# EAGLE design RGb Strip (EAGLE 6.5.0)
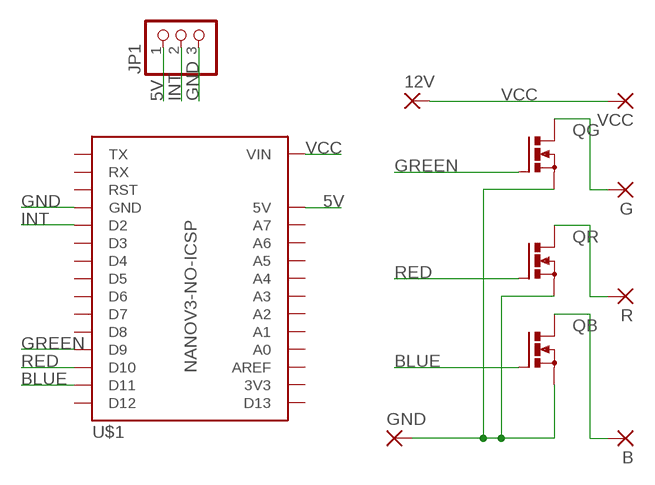
[diagram p0: schematic, sheet 1]

## Parts
12V  1,6/0,9  [1,6/0,9]
B  1,6/0,9  [1,6/0,9]
G  1,6/0,9  [1,6/0,9]
GND  1,6/0,9  [1,6/0,9]
JP1  PINHD-1X3  [1X03]
QB  PMOSFET_NTO220BV  [TO220BV]
QG  PMOSFET_NTO220BV  [TO220BV]
QR  PMOSFET_NTO220BV  [TO220BV]
R  1,6/0,9  [1,6/0,9]
U$1  NANOV3-NO-ICSP  [NANOV3-NO-ICSP]
VCC  1,6/0,9  [1,6/0,9]

## Nets
5V: JP1.1 U$1.5V
BLUE: QB.G U$1.D11
GND: GND.1(P) JP1.3 QB.S QG.S QR.S U$1.GND@1(GND) U$1.GND@2(GND)
GREEN: QG.G U$1.D9
INT: JP1.2 U$1.D2
N$8: QR.D R.1(P)
N$9: B.1(P) QB.D
N$10: G.1(P) QG.D
RED: QR.G U$1.D10
VCC: 12V.1(P) U$1.VIN VCC.1(P)
Unconnected: U$1.3V3 U$1.A0 U$1.A1 U$1.A2 U$1.A3 U$1.A4 U$1.A5 U$1.A6 U$1.A7 U$1.AREF U$1.D3 U$1.D4 U$1.D5 U$1.D6 U$1.D7 U$1.D8 U$1.D12 U$1.D13 U$1.RST1(RST) U$1.RST2(RST) U$1.RX U$1.TX

## Library data of the parts
12V B G GND R VCC = wirepad:1,6/0,9: THROUGH-HOLE PAD
JP1 = pinhead:PINHD-1X3: PIN HEADER
QB QG QR = transistor-power:PMOSFET_N: Power MOSFET N-Channel
U$1 = Franc:NANOV3-NO-ICSP: Nano V3 without the ICSP header

## Board
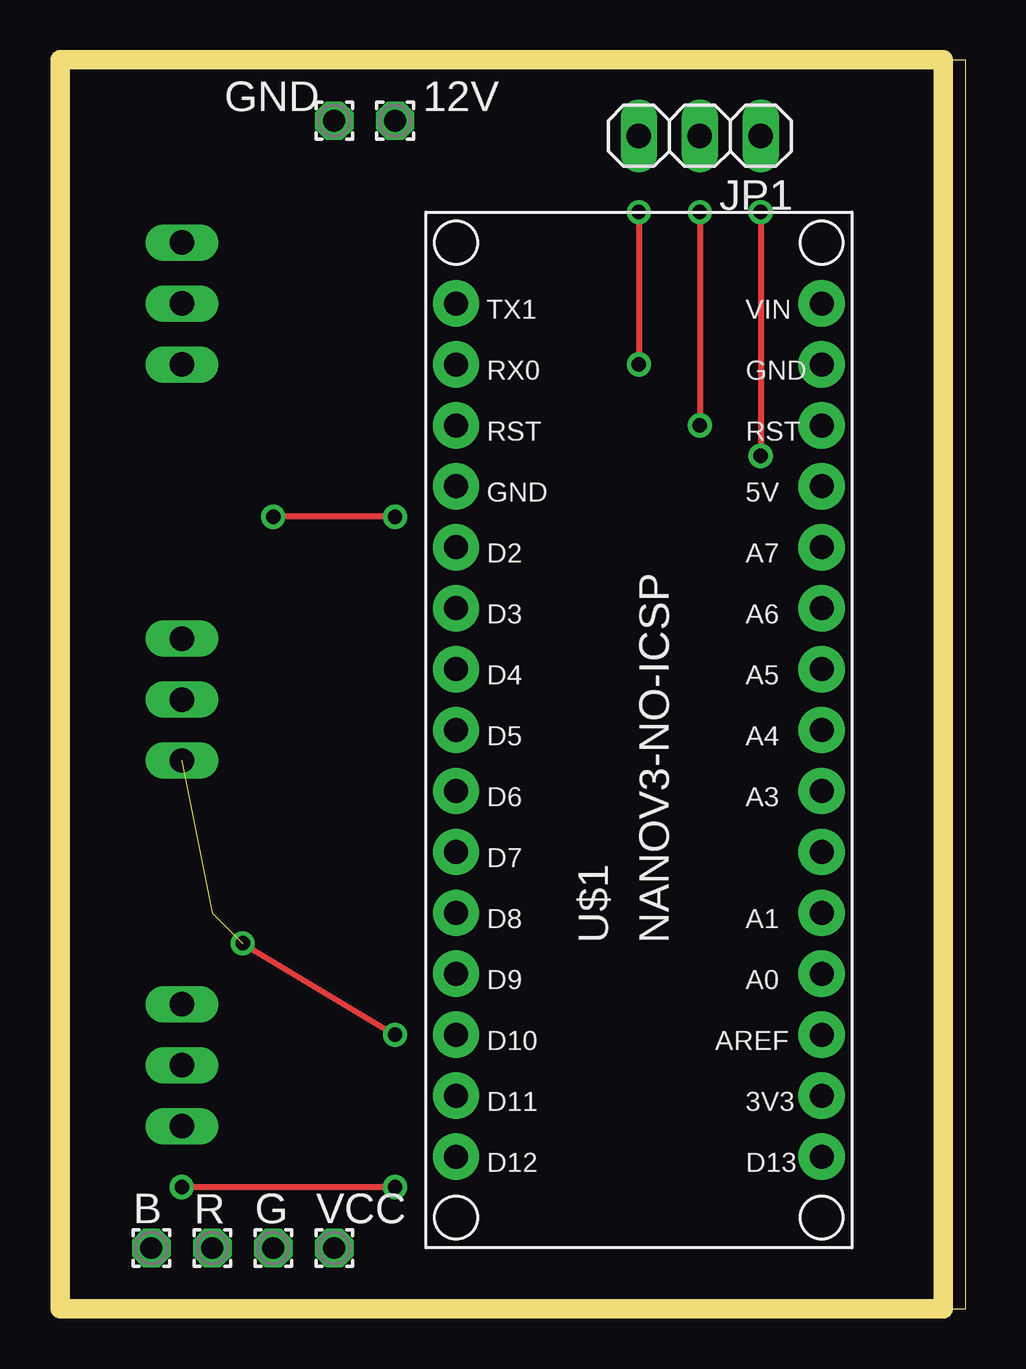
[diagram p1: board, top side]
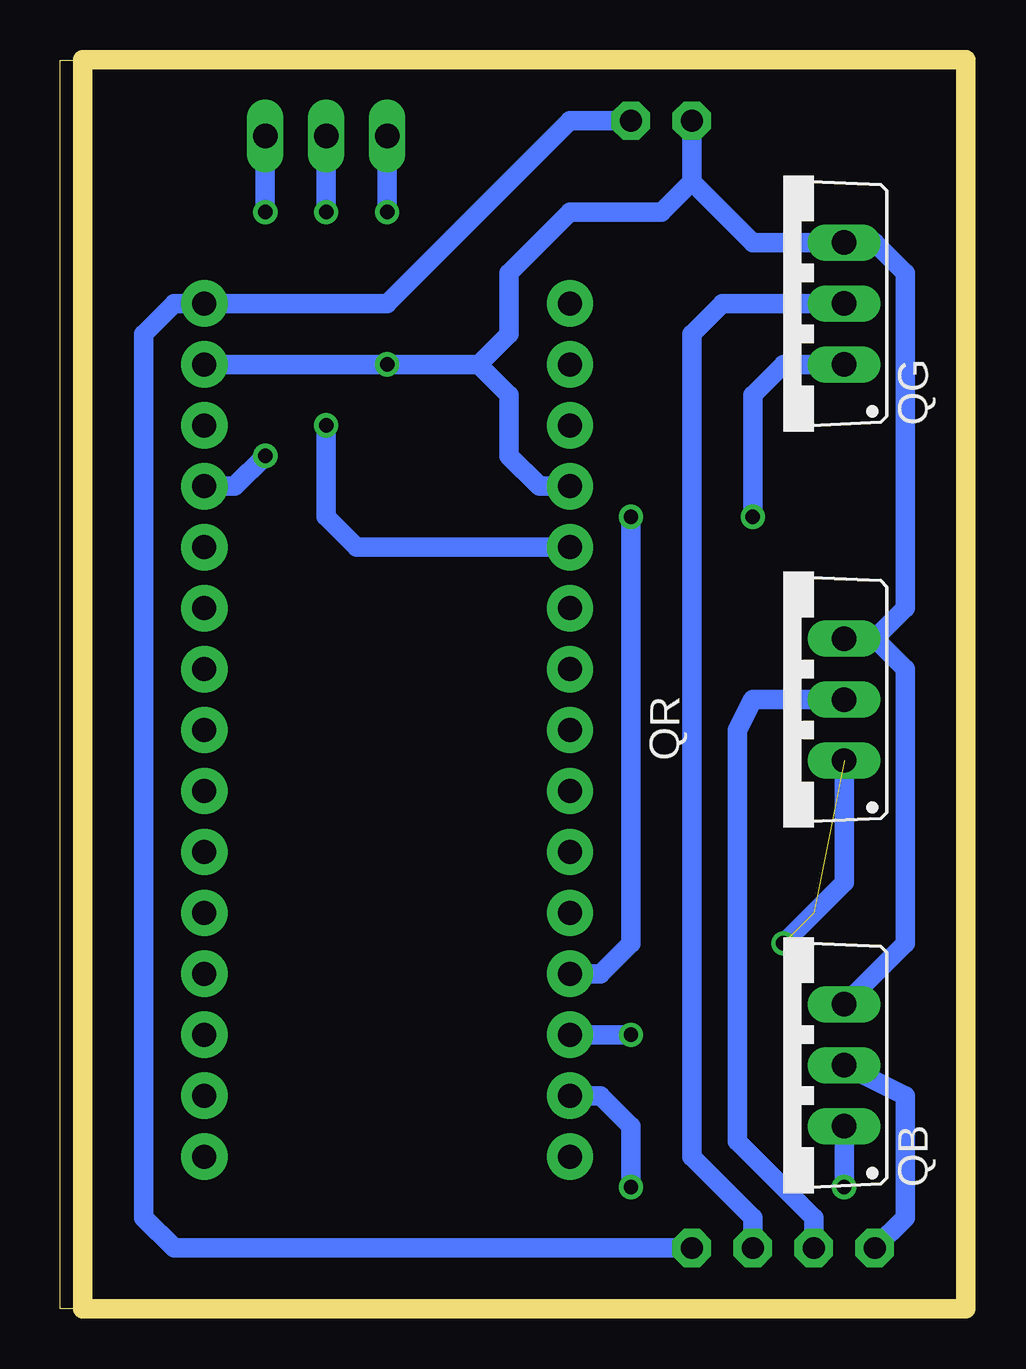
[diagram p2: board, bottom side, seen from below]

Size 37.77 x 52.06 mm. Coordinates in mm from the lower left corner, seen from the top.
Outline: 0,0 37.77,0 37.77,52.06 0,52.06 0,0
Copper layers (1*16): Top 0.035mm / dielectric 1.5mm / Bottom 0.035mm
Design rules "default": minimum track width 10mil, minimum drill 24mil, track to track 8mil, track to pad 8mil, pad to pad 8mil, via to via 8mil, smd to smd 8mil, copper to edge 40mil, drill to drill 8mil, minimum pad ring 10mil, minimum via ring 8mil, stop-mask expansion 4mil, vias tented up to drill 0mil, thermal gap 10mil
Milling: 4 lines

### Footprints (pad centres in the part's own frame; a part is rotated, then mirrored left to right if it is on the bottom)
1,6/0,9 = drill 0.914 pad 1.6 octagon: 1 0,0
1X03 = drill 1.016 long: 1 -2.54,0; 2 0,0; 3 2.54,0
TO220BV = drill 1.016 long: D 0,-2.54; G -2.54,-2.54; S 2.54,-2.54
NANOV3-NO-ICSP = drill 1 pad 1.93: 3V3 3.81,-13.97; 5V 3.81,11.43; A0 3.81,-8.89; A1 3.81,-6.35; A2 3.81,-3.81; A3 3.81,-1.27; A4 3.81,1.27; A5 3.81,3.81; A6 3.81,6.35; A7 3.81,8.89; AREF 3.81,-11.43; D2 -11.43,8.89; D3 -11.43,6.35; D4 -11.43,3.81; D5 -11.43,1.27; D6 -11.43,-1.27; D7 -11.43,-3.81; D8 -11.43,-6.35; D9 -11.43,-8.89; D10 -11.43,-11.43; D11 -11.43,-13.97; D12 -11.43,-16.51; D13 3.81,-16.51; GND@1 -11.43,11.43; GND@2 3.81,16.51; RST1 -11.43,13.97; RST2 3.81,13.97; RX -11.43,16.51; TX -11.43,19.05; VIN 3.81,19.05

### Placement (x,y rotation side)
12V  13.97,49.53 0 top
B  3.81,2.54 0 top
G  8.89,2.54 0 top
GND  11.43,49.53 0 top
JP1  26.67,48.9 180 top
QB  7.62,10.16 90 bottom
QG  7.62,41.91 90 bottom
QR  7.62,25.4 90 bottom
R  6.35,2.54 0 top
U$1  27.94,22.86 0 top
VCC  11.43,2.54 0 top

### Tracks (layer width: path | path; a pad name or v marks a point on that pad's centre or on a via)
5V  (via drill 0.6)
  Top 0.25: v29.21,45.72 v29.21,35.56
  Bottom 0.813: JP1.1 v29.21,45.72 | U$1.5V 30.48,34.29 v29.21,35.56
BLUE  (via drill 0.6)
  Top 0.25: v13.97,5.08 v5.08,5.08
  Bottom 0.813: v13.97,5.08 13.97,7.62 15.24,8.89 U$1.D11 | QB.G v5.08,5.08
GND  (via drill 0.6)
  Top 0.25: v24.13,45.72 v24.13,39.37
  Bottom 0.813: 20.32,39.37 v24.13,39.37 U$1.GND@2 | JP1.3 v24.13,45.72 | U$1.GND@1 17.78,34.29 19.05,35.56 19.05,38.1 20.32,39.37 | 20.32,39.37 19.05,40.64 19.05,43.18 16.51,45.72 12.7,45.72 11.43,46.99 | QB.S 2.54,15.24 2.54,26.67 3.81,27.94 | 3.81,27.94 QR.S | 3.81,27.94 2.54,29.21 2.54,43.18 3.81,44.45 QG.S 8.89,44.45 11.43,46.99 | 11.43,46.99 GND.1
GREEN  (via drill 0.6)
  Top 0.25: v13.97,33.02 v8.89,33.02
  Bottom 0.813: v8.89,33.02 8.89,38.1 7.62,39.37 QG.G | U$1.D9 15.24,13.97 13.97,15.24 v13.97,33.02
INT  (via drill 0.6)
  Top 0.25: v26.67,45.72 v26.67,36.83
  Bottom 0.813: JP1.2 v26.67,45.72 | v26.67,36.83 26.67,33.02 25.4,31.75 U$1.D2
N$8
  Bottom 0.813: R.1 6.35,3.81 9.53,6.99 9.53,24.13 8.89,25.4 QR.D
N$9
  Bottom 0.813: QB.D 2.54,8.89 2.54,3.81 B.1
N$10
  Bottom 0.813: G.1 8.89,3.81 11.43,6.35 11.43,40.64 10.16,41.91 QG.D
RED  (via drill 0.6)  (2 unrouted)
  Top 0.25: v7.62,15.24 v13.97,11.43
  Bottom 0.813: U$1.D10 v13.97,11.43 | QR.G 5.08,17.78 v7.62,15.24
VCC
  Bottom 0.813: VCC.1 33.02,2.54 34.29,3.81 34.29,40.64 33.02,41.91 U$1.VIN 24.13,41.91 16.51,49.53 12V.1